# EasyEDA schematic SCH_YMF288-M MegaMod_2021-11-02.json

## Sheets
1 MAIN: TITLE: YMF288-M Mod; REV: 1.0; Date: 2021-02-03; Sheet: 1/1; Drawn By: Denjhang; Company: Denjhang
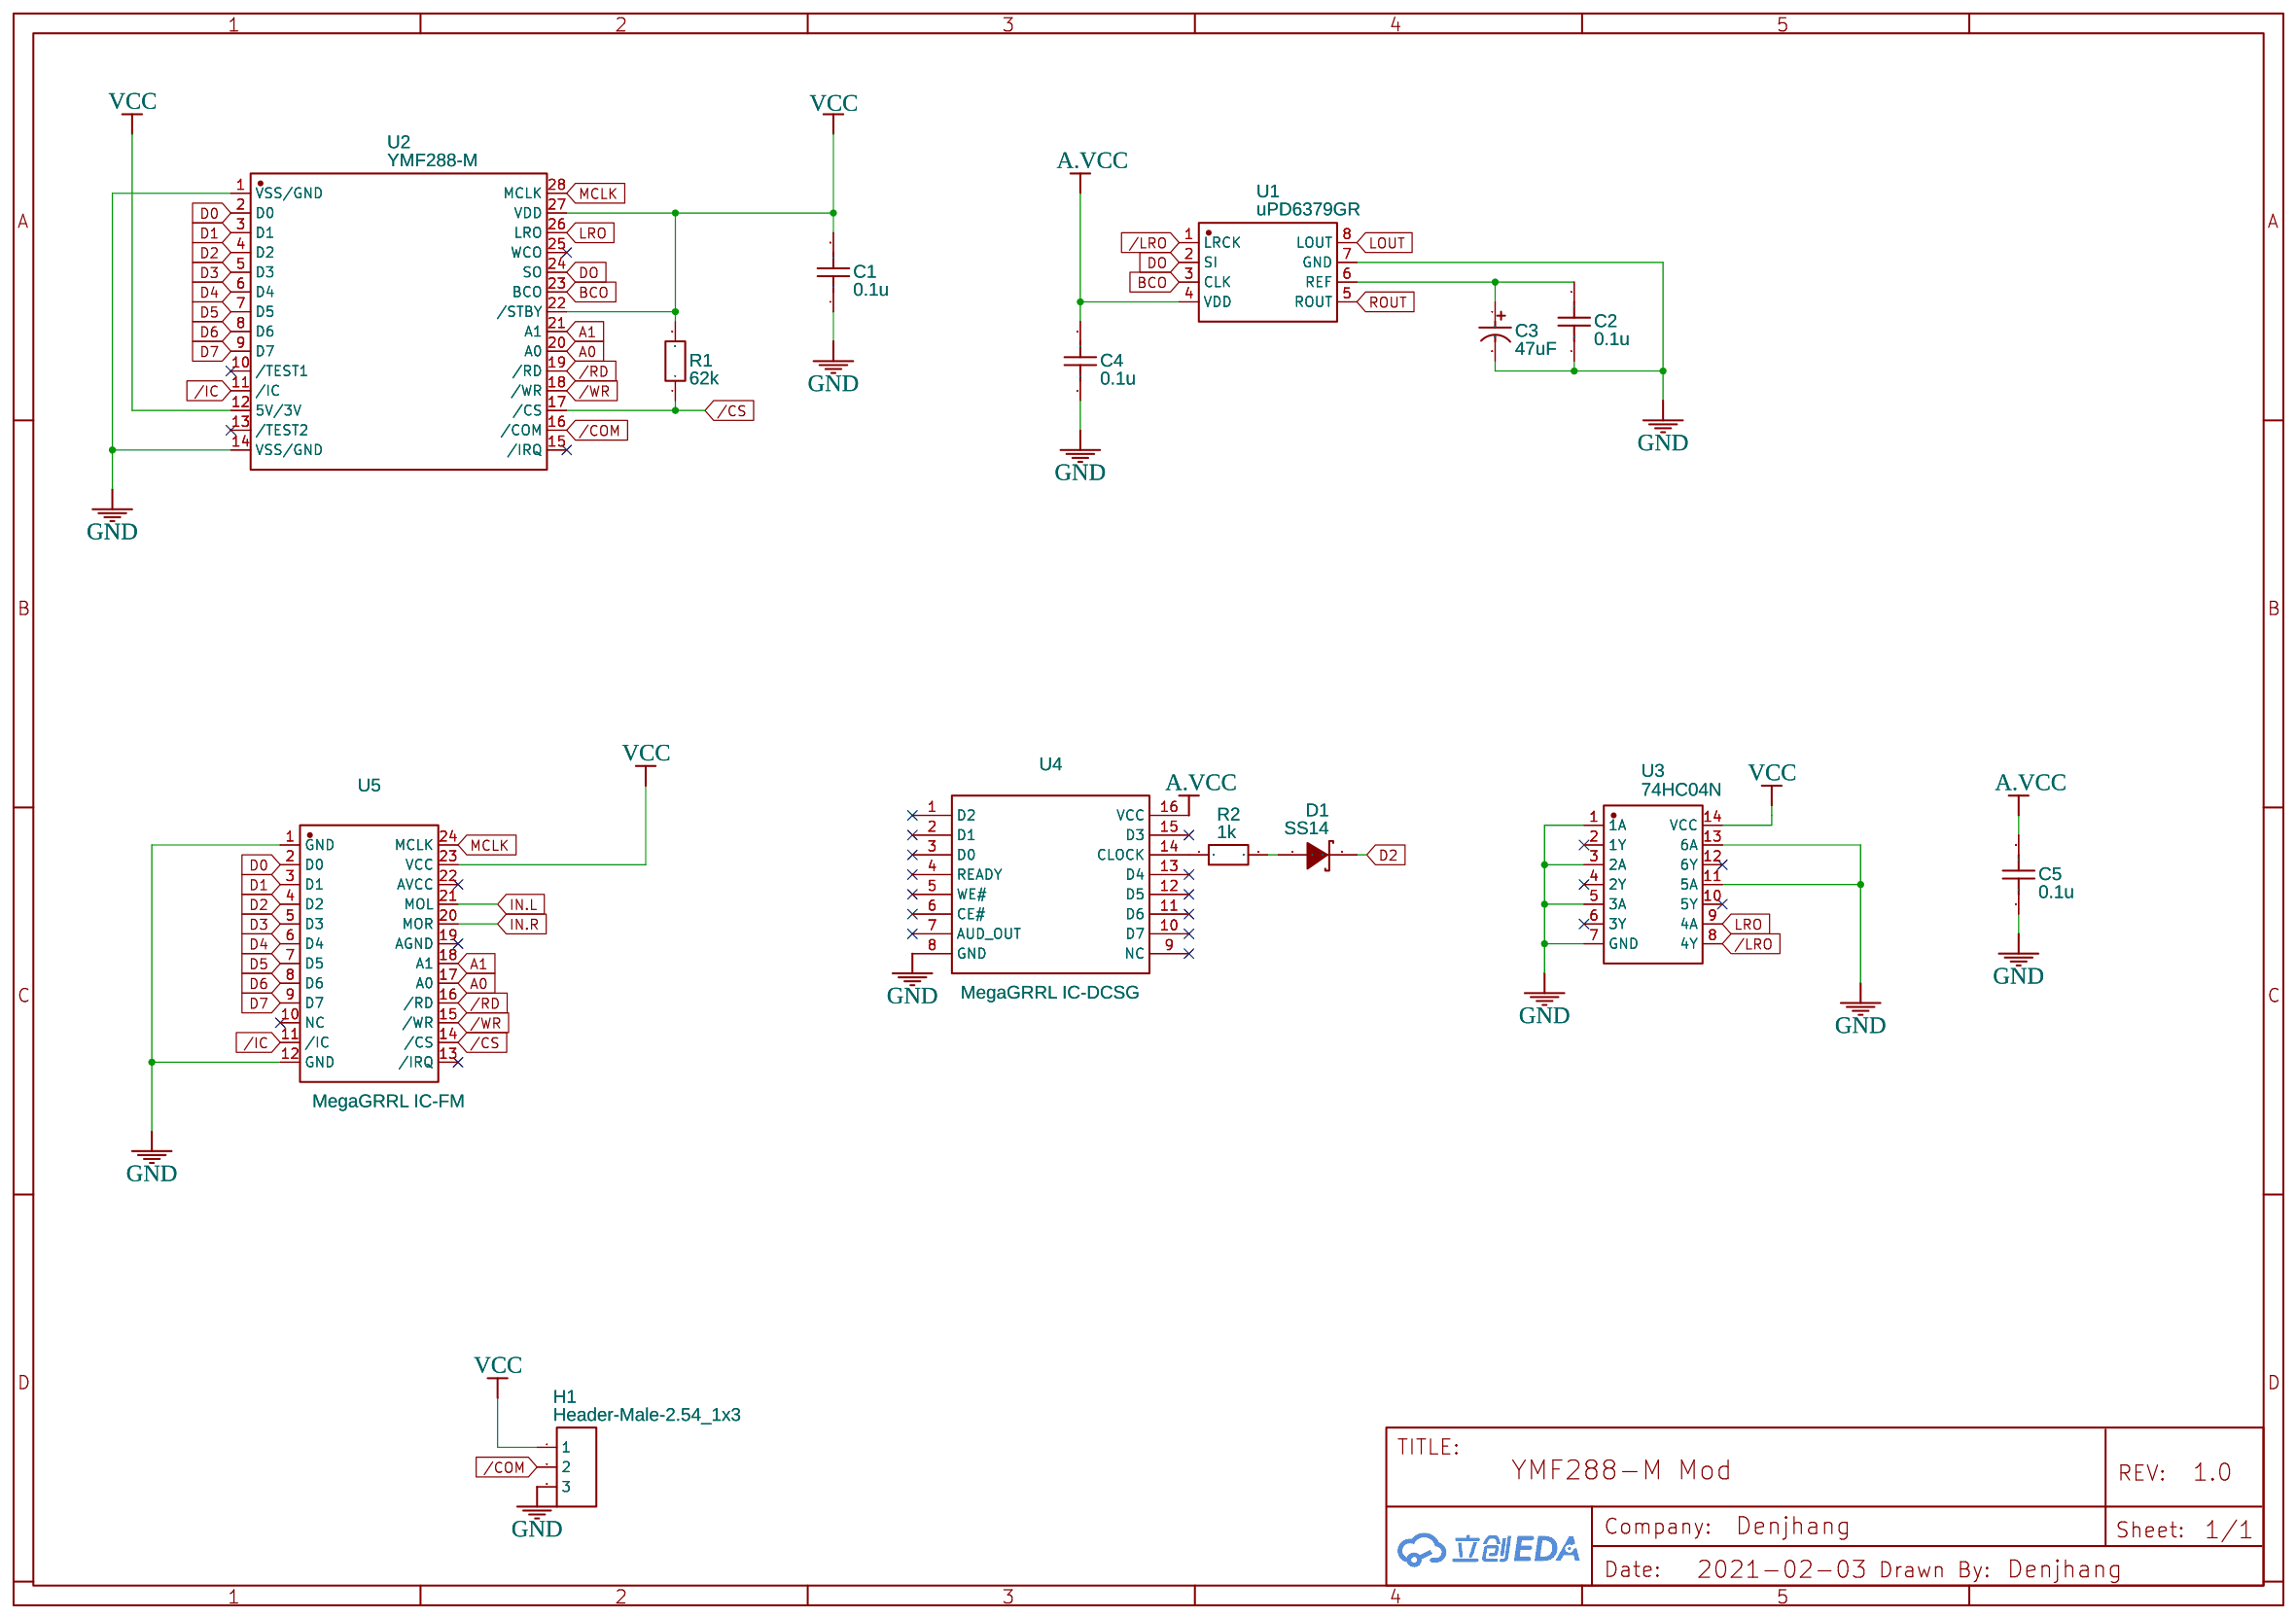
[diagram p0: MAIN]
2 AMP: TITLE: Sheet_1; Date: 2021-11-01; Company: Your Company
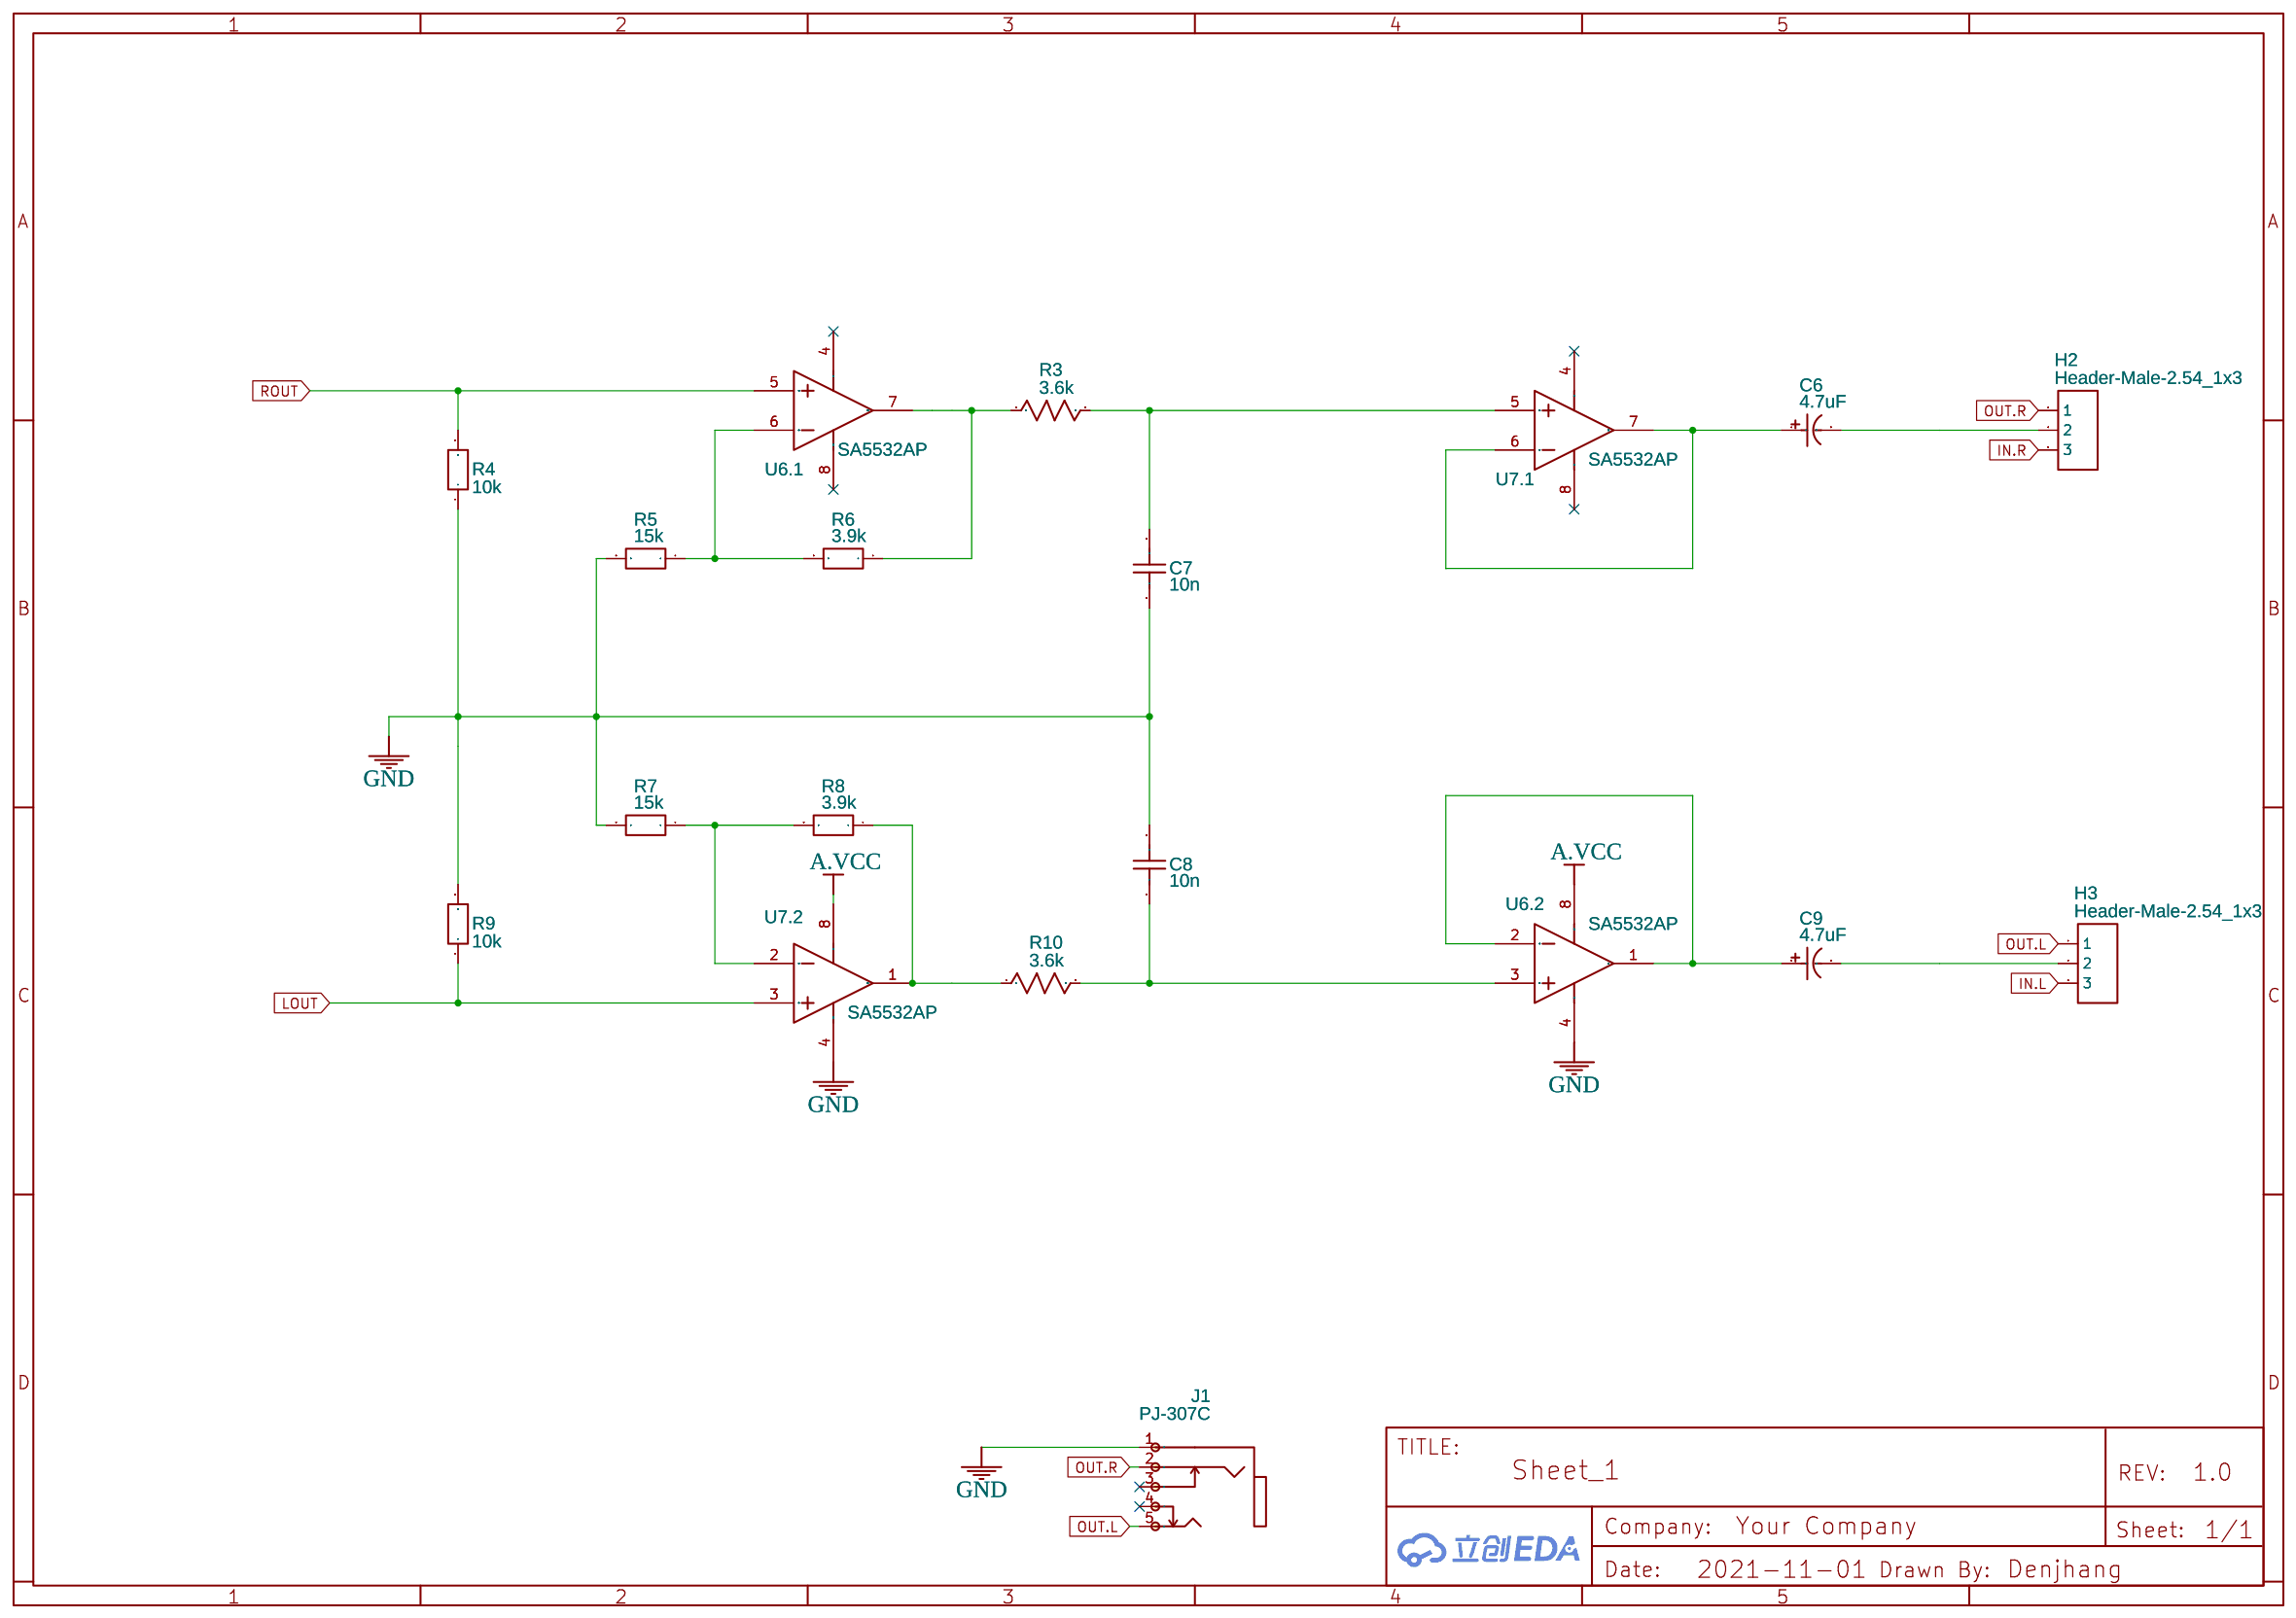
[diagram p1: AMP]

## Parts
sheet AMP
C6  4.7uF  [CAP-TH_BD6.3-P2.50-D1.0-FD]
C7  10n  [C0603]
C8  10n  [C0603]
C9  4.7uF  [CAP-TH_BD6.3-P2.50-D1.0-FD]
H2  Header-Male-2.54_1x3  [HDR-TH_3P-P2.54-V-M-1]
H3  Header-Male-2.54_1x3  [HDR-TH_3P-P2.54-V-M-1]
J1  PJ-307C  [AUDIO-TH_PJ307C]
R3  3.6k  [R0603]
R4  10k  [R0603]
R5  15k  [R0603]
R6  3.9k  [R0603]
R7  15k  [R0603]
R8  3.9k  [R0603]
R9  10k  [R0603]
R10  3.6k  [R0603]
U6  SA5532AP  [DIP8]  (sections 1,2)
U7  SA5532AP  [DIP8]  (sections 1,2)
sheet MAIN
C1  0.1u  [C0603]
C2  0.1u  [C0603]
C3  47uF  [CAP-TH_BD4.0-P1.50-D0.8-FD]
C4  0.1u  [C0603]
C5  0.1u  [C0603]
D1  SS14  [SMA_L4.4-W2.8-LS5.4-RD]
H1  Header-Male-2.54_1x3  [HDR-TH_3P-P2.54-V-M-1]
R1  62k  [R0603]
R2  1k  [R0603]
U1  uPD6379GR  [SOIC-8_L5.0-W4.0-P1.27-LS6.0-BL]
U2  YMF288-M  [SOP-28-YMF288]
U3  74HC04N  [DIP-14_L19.2-W6.6-P2.54-LS10.9-BL]
U4  MegaGRRL IC-DCSG  [DIP-16_L20.4-W5.8-P2.54-LS7.6-BL]
U5  MegaGRRL IC-FM  [DIP-24_L32.0-W13.8-P2.54-LS15.6-BL]

## Library data of the parts
C6 C9 = 25V 47uF: Supplier: LCSC; Manufacturer: ValuePro; Manufacturer Part: 电解电容25V 47uF; Supplier Part: C45704; JLCPCB Part Class: Extended Part
C1 C2 C4 C5 C7 C8 = C_0603_US: Contributor: LCEDA_Lib
H1-H3 = Header-Male-2.54_1x3: Supplier: LCSC; Manufacturer: BOOMELE; Manufacturer Part: Header2.54mm 1*3P; Supplier Part: C49257; JLCPCB Part Class: Extended Part
J1 = PJ-307C: Supplier: LCSC; Manufacturer: BOOMELE; Supplier Part: C16684; JLCPCB Part Class: Extended Part
R3 R10 = R_0603_US: Contributor: LCEDA_Lib
R1 R2 R4-R9 = R_0603_EU: Contributor: LCEDA_Lib
U6 U7 = SA5532AP: Dual Low-Noise Operational Amplifier, 10 to 30 V, -40 to 85 degC, 8-pin DIP (P8), Pb-Free (RoHS); subpart_no: 1
C3 = 47uF 10V 4*5: Supplier: LCSC; Manufacturer: ValuePro; Supplier Part: C43312; JLCPCB Part Class: Extended Part
D1 = SS14: Supplier: LCSC; Manufacturer: MDD; Supplier Part: C2480; JLCPCB Part Class: Basic Part
U1 = uPD6379GR: Manufacturer: NEC; Contributor: Denjhang
U2 = YMF288-M: Supplier Part: YMF288-M-SOP28; Manufacturer: YAMAHA; Manufacturer Part: YMF288-M-SOP28; Contributor: Denjhang; SMT Type: Extend; JLCPCB SMD: Yes
U3 = 74HC04N: Supplier: LCSC; Supplier Part: C669327; Manufacturer: HTC Korea TAEJIN Tech; Contributor: LCSC; JLCPCB Part Class: Extended Part
U4 = SN76489AN: Manufacturer: Texas Instruments; Contributor: re1mu
U5 = MegaGRRL IC-FM: Supplier Part: C707077; Manufacturer: YAMAHA; Manufacturer Part: YM2612; Contributor: Denjhang; JLCPCB SMD: Yes; SMT Type: Extend

## Nets
GND: C1.1 C2.1 C3.2 C4.1 C5.1 C7.1 C8.2 H1.3 J1.1 R4.1 R5.2 R7.2 R9.2 U1.7(GND) U2.1(VSS/GND) U2.14(VSS/GND) U3.1(1A) U3.3(2A) U3.5(3A) U3.7(GND) U3.11(5A) U3.13(6A) U4.8(GND) U5.1(GND) U5.12(GND) U6.4(VCC-) U7.4(VCC-)
VCC: C1.2 H1.1 R1.2 U2.12(5V/3V) U2.22(/STBY) U2.27(VDD) U3.14(VCC) U5.23(VCC)
/COM: H1.2 U2.16(/COM)
/CS: R1.1 U2.17(/CS) U5.14(/CS)
/IC: U2.11(/IC) U5.11(/IC)
/LRO: U1.1(LRCK) U3.8(4Y)
/RD: U2.19(/RD) U5.16(/RD)
/WR: U2.18(/WR) U5.15(/WR)
A0: U2.20(A0) U5.17(A0)
A1: U2.21(A1) U5.18(A1)
A.VCC: C4.2 C5.2 U1.4(VDD) U4.16(VCC) U6.8(VCC+) U7.8(VCC+)
BCO: U1.3(CLK) U2.23(BCO)
D0: U2.2(D0) U5.2(D0)
D1: U2.3(D1) U5.3(D1)
D2: D1.1(K) U2.4(D2) U5.4(D2)
D3: U2.5(D3) U5.5(D3)
D4: U2.6(D4) U5.6(D4)
D5: U2.7(D5) U5.7(D5)
D6: U2.8(D6) U5.8(D6)
D7: U2.9(D7) U5.9(D7)
DO: U1.2(SI) U2.24(SO)
IN.L: H3.3 U5.21(MOL)
IN.R: H2.3 U5.20(MOR)
LOUT: R9.1 U1.8(LOUT) U7.3(IN1+)
LRO: U2.26(LRO) U3.9(4A)
MCLK: U2.28(MCLK) U5.24(MCLK)
OUT.L: H3.1 J1.5
OUT.R: H2.1 J1.2
ROUT: R4.2 U1.5(ROUT) U6.5(IN2+)
Net-(C2-2): C2.2 C3.1 U1.6(REF)
Net-(C6-1): C6.1 U7.6(IN2-) U7.7(OUT2)
Net-(C6-2): C6.2 H2.2
Net-(C7-2): C7.2 R3.2 U7.5(IN2+)
Net-(C8-1): C8.1 R10.2 U6.3(IN1+)
Net-(C9-1): C9.1 U6.1(OUT1) U6.2(IN1-)
Net-(C9-2): C9.2 H3.2
Net-(D1-2): D1.2(A) R2.2
Net-(R2-1): R2.1 U4.14(CLOCK)
Net-(R3-1): R3.1 R6.1 U6.7(OUT2)
Net-(R5-1): R5.1 R6.2 U6.6(IN2-)
Net-(R7-1): R7.1 R8.2 U7.2(IN1-)
Net-(R8-1): R8.1 R10.1 U7.1(OUT1)

Not connected (* = marked no-connect by the designer): J1 3* 4*; U2 10(/TEST1)* 13(/TEST2)* 15(/IRQ)* 25(WCO)*; U3 2(1Y)* 4(2Y)* 6(3Y)* 10(5Y)* 12(6Y)*; U4 1(D2)* 2(D1)* 3(D0)* 4(READY)* 5(WE#)* 6(CE#)* 7(AUD OUT)* 9(NC)* 10(D7)* 11(D6)* 12(D5)* 13(D4)* 15(D3)*; U5 10(NC)* 13(/IRQ)* 19(AGND)* 22(AVCC)*
